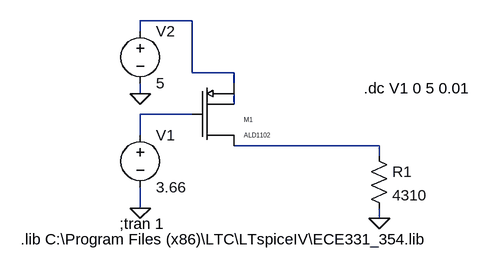
[diagram p0: schematic Draft1-2.asc]
Draft1-2.asc, the LTspice schematic file:
Version 4
SHEET 1 880 680
WIRE 16 0 -64 0
WIRE -64 16 -64 0
WIRE 16 80 16 0
WIRE 80 80 16 80
WIRE 80 96 80 80
WIRE -64 112 -64 96
WIRE 80 128 80 112
WIRE 16 144 -64 144
WIRE -64 176 -64 144
WIRE 304 192 80 192
WIRE 304 208 304 192
WIRE -64 288 -64 256
WIRE 304 304 304 288
FLAG -64 288 0
FLAG -64 112 0
FLAG 304 304 0
SYMBOL voltage -64 160 R0
WINDOW 123 0 0 Left 2
WINDOW 39 0 0 Left 2
SYMATTR InstName V1
SYMATTR Value 3.66
SYMBOL voltage -64 0 R0
WINDOW 123 0 0 Left 2
WINDOW 39 0 0 Left 2
SYMATTR InstName V2
SYMATTR Value 5
SYMBOL ALD1102 16 96 R0
SYMATTR InstName M1
SYMBOL res 288 192 R0
SYMATTR InstName R1
SYMATTR Value 4310
TEXT -96 312 Left 2 !;tran 1
TEXT -248 336 Left 2 !.lib C:\\Program Files (x86)\\LTC\\LTspiceIV\\ECE331_354.lib
TEXT 280 104 Left 2 !.dc V1 0 5 0.01

The netlist it stands for:
* Draft1-2.asc
V1 N003 0 3.66
V2 N001 0 5
M1 N004 N003 N001 N002 ALD1102 W=1.739e-3 L=1e-6
R1 N004 0 4310
.model NMOS NMOS
.model PMOS PMOS
.lib standard.mos
;tran 1
.lib C:\Program Files (x86)\LTC\LTspiceIV\ECE331_354.lib
.dc V1 0 5 0.01
.backanno
.end